# Altium schematic sheet W-F-FC-HX3X.SchDoc: PCB_Project_WNDCVX1X_CONTROL_BOARD
size A4; DrawnBy: Raihan Bin Mofidul; Organization: Walton Hi-Tech Industries Ltd.; DocumentNumber: 1; Revision: 1; SheetNumber: 1
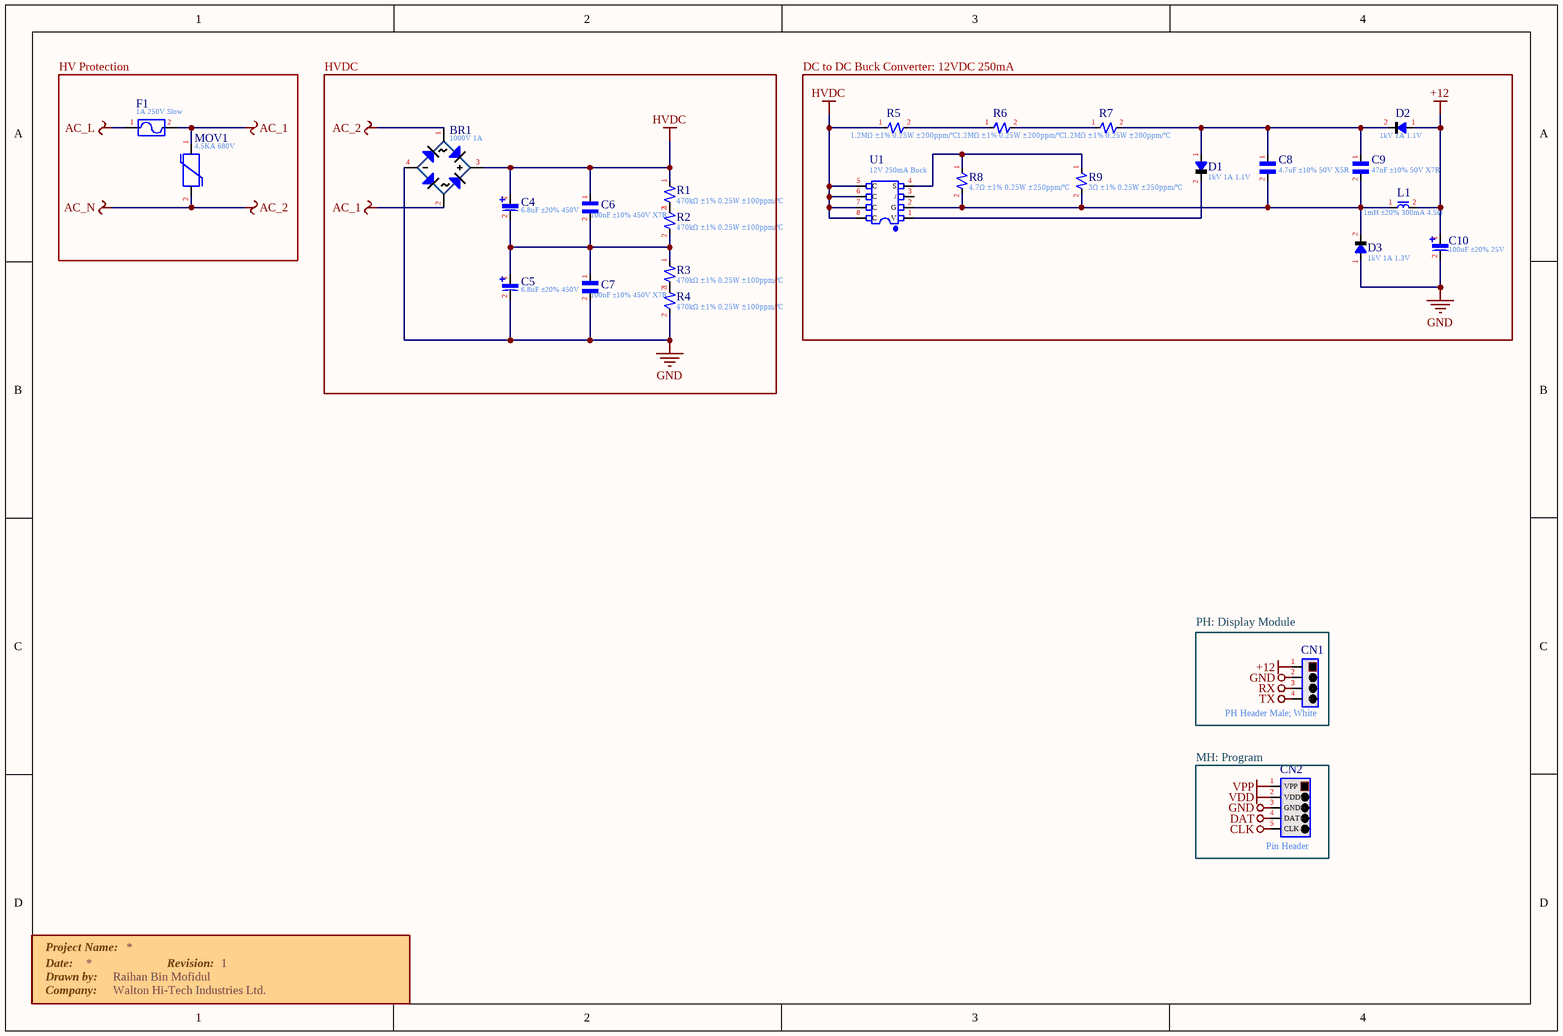
[diagram p0: W-F-FC-HX3X.SchDoc]

## Parts
BR1  1000V 1A  [D_SMD_MBS]
C4  6.8uF ±20% 450V  [C_SMD_Ø10*13mm]
C5  6.8uF ±20% 450V  [C_SMD_Ø10*13mm]
C6  100nF ±10% 450V X7R  [C_1206]
C7  100nF ±10% 450V X7R  [C_1206]
C8  4.7uF ±10% 50V X5R  [C_0805]
C9  47nF ±10% 50V X7R  [C_0805]
C10  100uF ±20% 25V  [C_SMD_Ø6.3*5.4mm]
CN1  PH Header Male; White  [CN_4P_A2001WR-S-XP-LCP]
CN2  Pin Header  [CN_PIC_MCU_Debugger_RightAngle]
D1  1kV 1A 1.1V  [D_DO-214AC]
D2  1kV 1A 1.1V  [D_DO-214AC]
D3  1kV 1A 1.3V  [D_DO-214AC]
F1  1A 250V Slow  [F_SQUARE_8.5*8_P5.08]
L1  1mH ±20% 300mA 4.5Ω  [L_SMD_6.0x6.0x4.5mm]
MOV1  4.5KA 680V  [MOV_14D561K]
R1  470kΩ ±1% 0.25W ±100ppm/℃  [R_1206]
R2  470kΩ ±1% 0.25W ±100ppm/℃  [R_1206]
R3  470kΩ ±1% 0.25W ±100ppm/℃  [R_1206]
R4  470kΩ ±1% 0.25W ±100ppm/℃  [R_1206]
R5  1.2MΩ ±1% 0.25W ±200ppm/℃  [R_1206]
R6  1.2MΩ ±1% 0.25W ±200ppm/℃  [R_1206]
R7  1.2MΩ ±1% 0.25W ±200ppm/℃  [R_1206]
R8  4.7Ω ±1% 0.25W ±250ppm/℃  [R_1206]
R9  3Ω ±1% 0.25W ±250ppm/℃  [R_1206]
U1  12V 250mA Buck  [U_SOP-8]

## Blocks framed on the sheet
HV Protection: F1 MOV1
HVDC: BR1 C4-C7 R1-R4
DC to DC Buck Converter: 12VDC 250mA: C8-C10 D1-D3 L1 R5-R9 U1
PH: Display Module: CN1
MH: Program: CN2

## Nets
+12: C10.1 CN1.1 D2.1(A) L1.2
AC_1: BR1.2(AC) F1.2 MOV1.1
AC_2: BR1.1(AC) MOV1.2  [also labelled AC_N]
AC_L: F1.1
CLK: CN2.5(CLK)
DAT: CN2.4(DAT)
GND: BR1.4(vss) C5.2 C7.2 C10.2 CN1.2 CN2.3(GND) D3.1(A) R4.2
HVDC: BR1.3(VCC) C4.1 C6.1 R1.1 R5.1 U1.5(C) U1.6(C) U1.7(C) U1.8(C)
RX: CN1.3
TX: CN1.4
VDD: CN2.2(VDD)
VPP: CN2.1(VPP)
NetC4_2: C4.2 C5.1 C6.2 C7.1 R2.2 R3.1
NetC8_1: C8.1 C9.1 D1.1(A) D2.2(K) R7.2
NetC8_2: C8.2 C9.2 D3.2(K) L1.1 R8.2 R9.2 U1.2(G)
NetD1_2: D1.2(K) U1.1(V)
NetR1_2: R1.2 R2.1
NetR3_2: R3.2 R4.1
NetR5_2: R5.2 R6.1
NetR6_2: R6.2 R7.1
NetR8_1: R8.1 R9.1 U1.4(S)

Not connected (* = marked no-connect by the designer): U1 3(/)

## Notes on the sheet
- Project Name:
- Date:
- Drawn by:
- Revision:
- Company:
- Title
- Size:
- A4
- Number:
- Time:
- Sheet
- of
- File:

## Library data of the parts
BR1 = Diode>> Bridge Rectifier: MB10S-10; MBS Bridge Rectifiers RoHS
C4 C5 = Capacitor>> Polar: VKME1302W6R8MV; 10x13mm Aluminum Electrolytic Capacitors - SMD RoHS
C6 C7 = Capacitor>> Non-Polar: NM1206B104K451CEGN; 1206 Multilayer Ceramic Capacitors MLCC - SMD/SMT RoHS
C8 = Capacitor>> Non-Polar: CL21A475KBQNNNE; 0805 Multilayer Ceramic Capacitors MLCC - SMD/SMT RoHS
C9 = Capacitor>> Non-Polar: CL21B473KBANNNC; 0805 Multilayer Ceramic Capacitors MLCC - SMD/SMT RoHS
C10 = Capacitor>> Polar: SMD,6.3x5.4mm Aluminum Electrolytic Capacitors - SMD RoHS
CN1 = Connector>> 4Pins: A2001WR-S-4P; Pin 0.079"(2.00mm) 4 SMD,P=2mm Wire To Board / Wire To Wire Connector RoHS
CN2 = Connector>> PIC Program: A2541WR-5P/MTB125-1105R1/PZ254R-11-05P ;5pins, right-angle 90degrees 2.54mm Through Hole,P=2.54mm Pin Header & Female Header RoHS
D1 D2 = Diode>> General Purpose: MDD  M7; SMA(DO-214AC) Diodes - General Purpose RoHS
D3 = Diode>> General Purpose: LGE RS1M; 1A 500ns SMA Diodes - Rectifiers - Fast Recovery RoHS
F1 = Fuse: Littelfuse 39211000440; TE5 Fuse, Time-Lag type, 250V rated, designed in accordance to IEC  60127-3.
L1 = Inductor>> General Purpose: YNR6045-102M; SMD,6.0x6.0x4.5mm Power Inductors RoHS
MOV1 = Varistor: VDR-14D681K; 560V 1120V 4.5KA 680V Through Hole,P=7.5MM Varistors RoHS
R1-R4 = Resistor>> General Purpose: RK73H2BTTD4703F; 1206 Chip Resistor - Surface Mount RoHS
R5-R7 = Resistor>> General Purpose: RK73H2BTTD1204F; 1206 Chip Resistor - Surface Mount RoHS
R8 = Resistor>> General Purpose: RS-06L4R70FT; 1206 Chip Resistor - Surface Mount RoHS
R9 = Resistor>> General Purpose: RS-06L3R00FT; 1206 Chip Resistor - Surface Mount RoHS
U1 = IC>> OB-SMPS 8pins: OB2225MCPA; SOP8 Switching Controllers RoHS